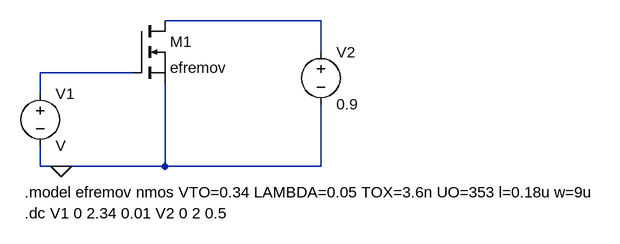
[diagram p0: schematic 1.asc]
1.asc, the LTspice schematic file:
Version 4
SHEET 1 880 680
WIRE 384 96 144 96
WIRE 384 144 384 96
WIRE 96 176 -48 176
WIRE -48 208 -48 176
WIRE -48 320 -48 288
WIRE -16 320 -48 320
WIRE 144 320 144 192
WIRE 144 320 -16 320
WIRE 384 320 384 224
WIRE 384 320 144 320
FLAG -16 320 0
SYMBOL nmos 96 96 R0
SYMATTR InstName M1
SYMATTR Value efremov
SYMBOL voltage -48 192 R0
SYMATTR InstName V1
SYMBOL voltage 384 128 R0
WINDOW 123 0 0 Left 0
WINDOW 39 0 0 Left 0
SYMATTR InstName V2
SYMATTR Value 0.9
TEXT -72 360 Left 2 !.model efremov nmos VTO=0.34 LAMBDA=0.05 TOX=3.6n UO=353 l=0.18u w=9u
TEXT -72 392 Left 2 !.dc V1 0 2.34 0.01 V2 0 2 0.5

The netlist it stands for:
* 1.asc
M1 N001 N002 0 0 efremov
V1 N002 0 V
V2 N001 0 0.9
.model NMOS NMOS
.model PMOS PMOS
.lib standard.mos
.model efremov nmos VTO=0.34 LAMBDA=0.05 TOX=3.6n UO=353 l=0.18u w=9u
.dc V1 0 2.34 0.01 V2 0 2 0.5
.backanno
.end